# Altium schematic sheet STM32_Brain.SchDoc
size A2; SheetNumber: 1; SheetTotal: 1
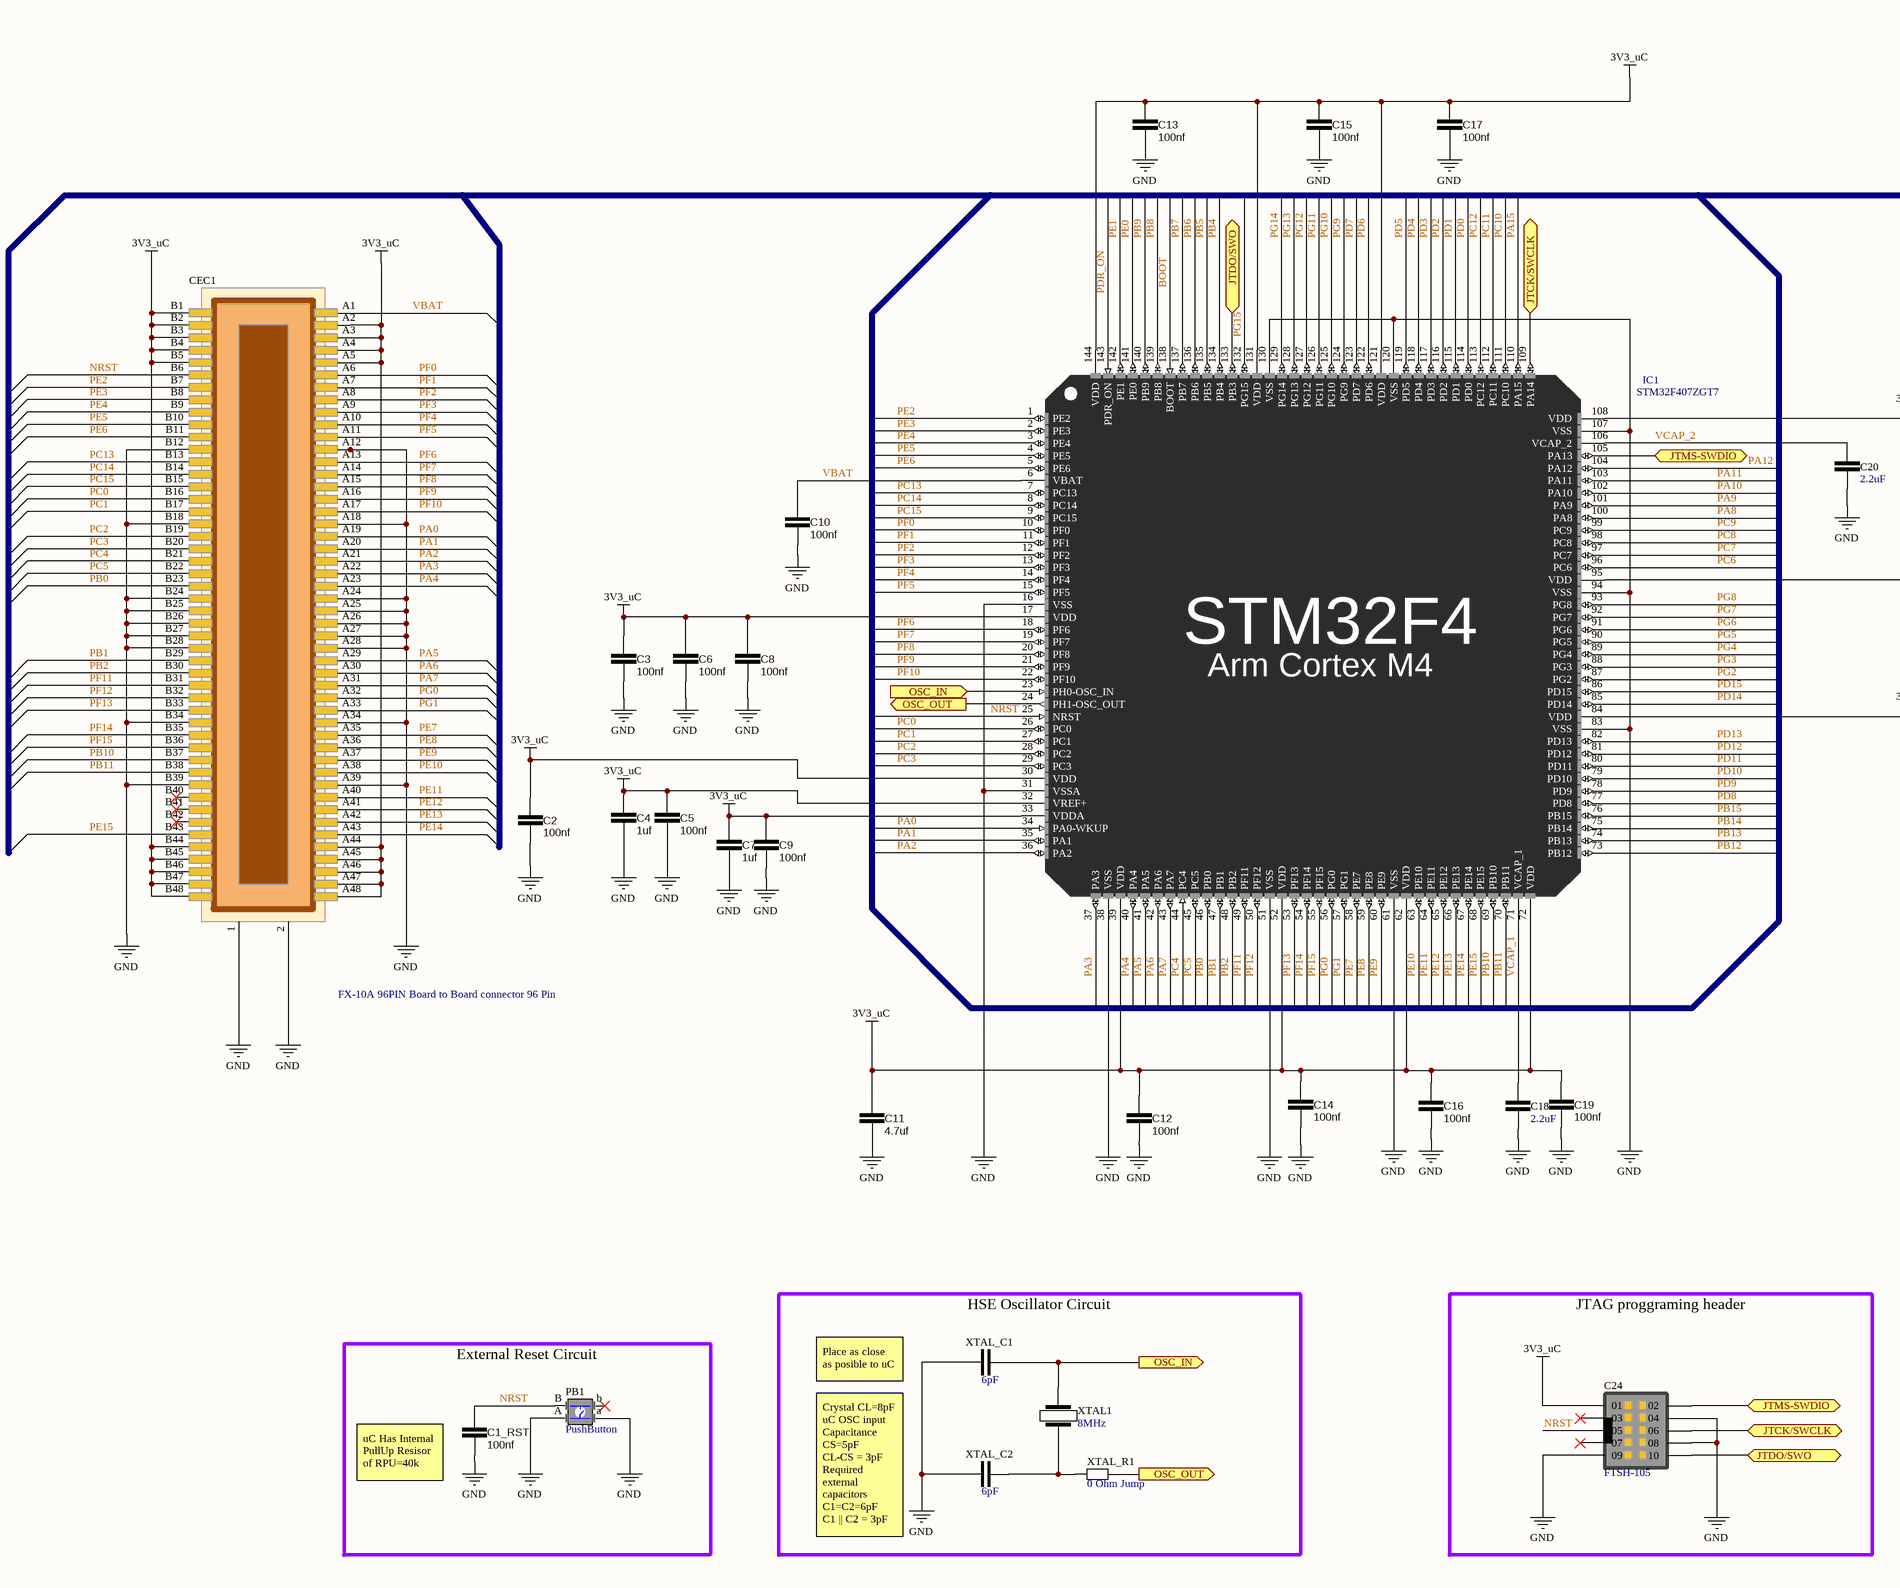
[diagram p0: STM32_Brain.SchDoc, left]
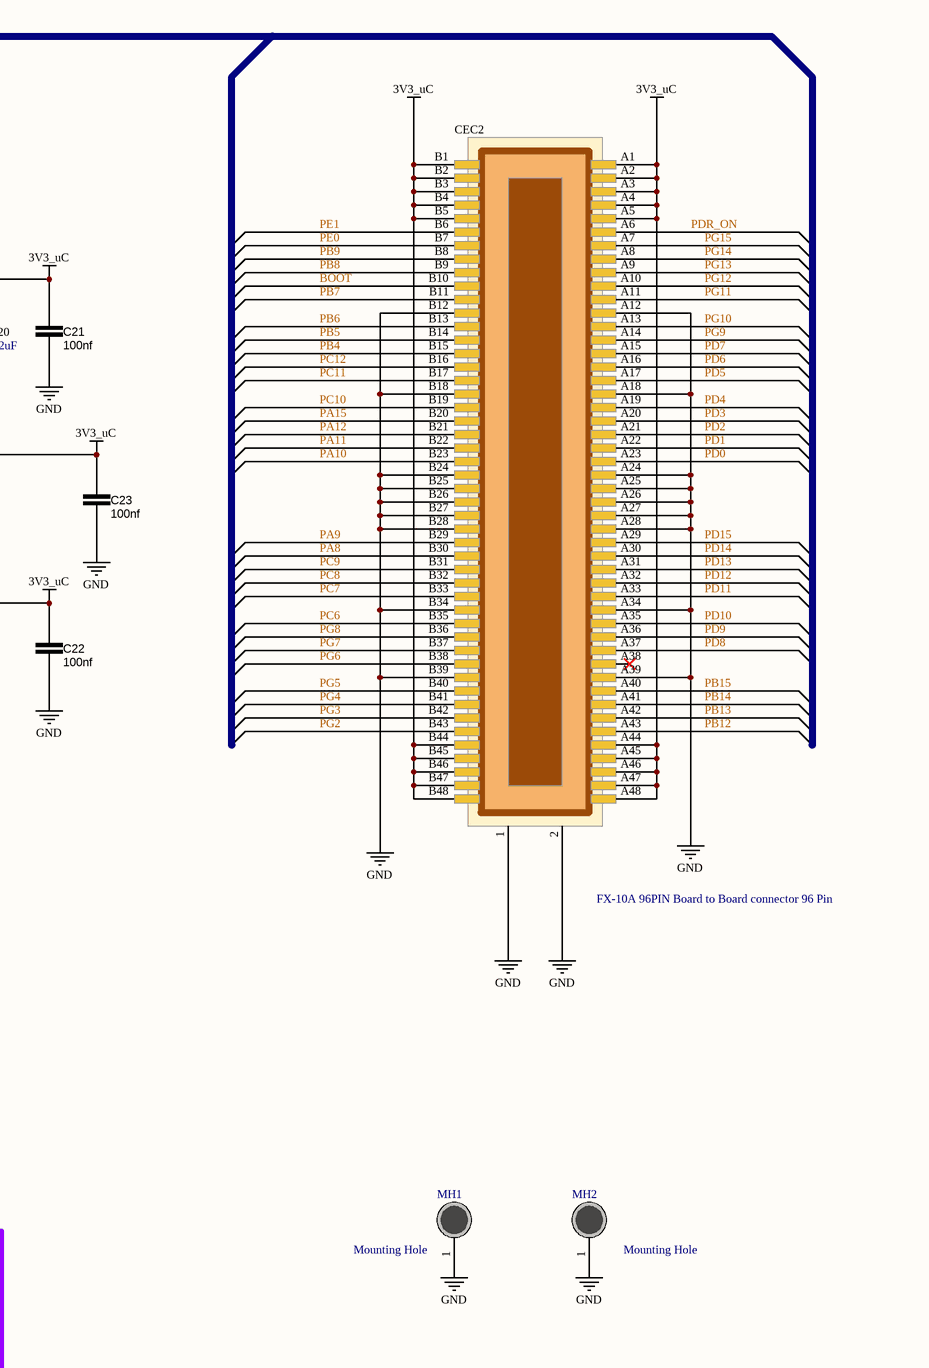
[diagram p1: STM32_Brain.SchDoc, right]

## Parts
C1_RST  100nf  [CAP_0603]
C2  100nf  [CAP_0603]
C3  100nf  [CAP_0603]
C4  1uf  [CAP_0603]
C5  100nf  [CAP_0603]
C6  100nf  [CAP_0603]
C7  1uf  [CAP_0603]
C8  100nf  [CAP_0603]
C9  100nf  [CAP_0603]
C10  100nf  [CAP_0603]
C11  4.7uf  [CAP_0805]
C12  100nf  [CAP_0603]
C13  100nf  [CAP_0603]
C14  100nf  [CAP_0603]
C15  100nf  [CAP_0603]
C16  100nf  [CAP_0603]
C17  100nf  [CAP_0603]
C18  2.2uF  [CAP_0603]
C19  100nf  [CAP_0603]
C20  2.2uF  [CAP_0603]
C21  100nf  [CAP_0603]
C22  100nf  [CAP_0603]
C23  100nf  [CAP_0603]
C24  FTSH-105  [10 Position SMT Connector]
CEC1  FX-10A 96PIN Board to Board connector 96 Pin  [Board To Board Connector]
CEC2  FX-10A 96PIN Board to Board connector 96 Pin  [Board To Board Connector]
IC1  STM32F407ZGT7  [TSQFP50P2260X2260X160-144N]
MH1  Mounting Hole  [HOLE-3mm]
MH2  Mounting Hole  [HOLE-3mm]
PB1  PushButton  [Tactile Switch]
XTAL1  8MHz  [XTAL-SMD]
XTAL_C1  6pF  [CAP_0402]
XTAL_C2  6pF  [CAP_0402]
XTAL_R1  0 Ohm Jump  [RES_0402]

## Ports
JTCK/SWCLK (bidir, see STM32_Brain[5B]), JTCK/SWCLK (bidir, see STM32_Brain[6D]), JTDO/SWO (bidir, see STM32_Brain[4B]), JTDO/SWO (bidir, see STM32_Brain[6D]), JTMS-SWDIO (bidir, see STM32_Brain[5B]), JTMS-SWDIO (bidir, see STM32_Brain[6D]), OSC_IN (in, see STM32_Brain[4D]), OSC_IN (out, see STM32_Brain[3C]), OSC_OUT (out, see STM32_Brain[3C]), OSC_OUT (out, see STM32_Brain[4D])

## Nets
3V3_uC: C2.2 C3.2 C4.2 C5.2 C6.2 C7.2 C8.2 C9.2 C11.2 C12.2 C13.2 C14.2 C15.2 C16.2 C17.2 C19.2 C21.2 C22.2 C23.2 C24.01 CEC1.A2 CEC1.A3 CEC1.A4 CEC1.A5 CEC1.A44 CEC1.A45 CEC1.A46 CEC1.A47 CEC1.A48 CEC1.B1 CEC1.B2 CEC1.B3 CEC1.B4 CEC1.B5 CEC1.B44 CEC1.B45 CEC1.B46 CEC1.B47 CEC1.B48 CEC2.A1 CEC2.A2 CEC2.A3 CEC2.A4 CEC2.A5 CEC2.A44 CEC2.A45 CEC2.A46 CEC2.A47 CEC2.A48 CEC2.B1 CEC2.B2 CEC2.B3 CEC2.B4 CEC2.B5 CEC2.B44 CEC2.B45 CEC2.B46 CEC2.B47 CEC2.B48 IC1.17(VDD) IC1.30(VDD) IC1.32(VREF+) IC1.33(VDDA) IC1.39(VDD) IC1.52(VDD) IC1.62(VDD) IC1.72(VDD) IC1.84(VDD) IC1.95(VDD) IC1.108(VDD) IC1.121(VDD) IC1.131(VDD) IC1.144(VDD)
GND: C1_RST.1 C2.1 C3.1 C4.1 C5.1 C6.1 C7.1 C8.1 C9.1 C10.1 C11.1 C12.1 C13.1 C14.1 C15.1 C16.1 C17.1 C18.1 C19.1 C20.1 C21.1 C22.1 C23.1 C24.04 C24.08 C24.09 CEC1.1 CEC1.2 CEC1.A12 CEC1.A18 CEC1.A24 CEC1.A25 CEC1.A26 CEC1.A27 CEC1.A28 CEC1.A34 CEC1.A39 CEC1.B12 CEC1.B18 CEC1.B24 CEC1.B25 CEC1.B26 CEC1.B27 CEC1.B28 CEC1.B34 CEC1.B39 CEC2.1 CEC2.2 CEC2.A12 CEC2.A18 CEC2.A24 CEC2.A25 CEC2.A26 CEC2.A27 CEC2.A28 CEC2.A34 CEC2.A39 CEC2.B12 CEC2.B18 CEC2.B24 CEC2.B25 CEC2.B26 CEC2.B27 CEC2.B28 CEC2.B34 CEC2.B39 IC1.16(VSS) IC1.31(VSSA) IC1.38(VSS) IC1.51(VSS) IC1.61(VSS) IC1.83(VSS) IC1.94(VSS) IC1.107(VSS) IC1.120(VSS) IC1.130(VSS) MH1.1 MH2.1 PB1.A PB1.a XTAL_C1.1 XTAL_C2.1
BOOT: CEC2.B10 IC1.138(BOOT)
JTCK/SWCLK: C24.06 IC1.109(PA14) ; port JTCK/SWCLK
JTDO/SWO: C24.10 IC1.133(PB3) ; port JTDO/SWO
JTMS-SWDIO: C24.02 IC1.105(PA13) ; port JTMS-SWDIO
NRST: C1_RST.2 C24.05 CEC1.B6 IC1.25(NRST) PB1.B
OSC_IN: IC1.23(PH0-OSC_IN) XTAL1.2 XTAL_C1.2 ; port OSC_IN
OSC_OUT: IC1.24(PH1-OSC_OUT) XTAL_R1.2 ; port OSC_OUT
PA0: CEC1.A19 IC1.34(PA0-WKUP)
PA1: CEC1.A20 IC1.35(PA1)
PA2: CEC1.A21 IC1.36(PA2)
PA3: CEC1.A22 IC1.37(PA3)
PA4: CEC1.A23 IC1.40(PA4)
PA5: CEC1.A29 IC1.41(PA5)
PA6: CEC1.A30 IC1.42(PA6)
PA7: CEC1.A31 IC1.43(PA7)
PA8: CEC2.B30 IC1.100(PA8)
PA9: CEC2.B29 IC1.101(PA9)
PA10: CEC2.B23 IC1.102(PA10)
PA11: CEC2.B22 IC1.103(PA11)
PA12: CEC2.B21 IC1.104(PA12)
PA15: CEC2.B20 IC1.110(PA15)
PB0: CEC1.B23 IC1.46(PB0)
PB1: CEC1.B29 IC1.47(PB1)
PB2: CEC1.B30 IC1.48(PB2)
PB4: CEC2.B15 IC1.134(PB4)
PB5: CEC2.B14 IC1.135(PB5)
PB6: CEC2.B13 IC1.136(PB6)
PB7: CEC2.B11 IC1.137(PB7)
PB8: CEC2.B9 IC1.139(PB8)
PB9: CEC2.B8 IC1.140(PB9)
PB10: CEC1.B37 IC1.69(PB10)
PB11: CEC1.B38 IC1.70(PB11)
PB12: CEC2.A43 IC1.73(PB12)
PB13: CEC2.A42 IC1.74(PB13)
PB14: CEC2.A41 IC1.75(PB14)
PB15: CEC2.A40 IC1.76(PB15)
PC0: CEC1.B16 IC1.26(PC0)
PC1: CEC1.B17 IC1.27(PC1)
PC2: CEC1.B19 IC1.28(PC2)
PC3: CEC1.B20 IC1.29(PC3)
PC4: CEC1.B21 IC1.44(PC4)
PC5: CEC1.B22 IC1.45(PC5)
PC6: CEC2.B35 IC1.96(PC6)
PC7: CEC2.B33 IC1.97(PC7)
PC8: CEC2.B32 IC1.98(PC8)
PC9: CEC2.B31 IC1.99(PC9)
PC10: CEC2.B19 IC1.111(PC10)
PC11: CEC2.B17 IC1.112(PC11)
PC12: CEC2.B16 IC1.113(PC12)
PC13: CEC1.B13 IC1.7(PC13)
PC14: CEC1.B14 IC1.8(PC14)
PC15: CEC1.B15 IC1.9(PC15)
PD0: CEC2.A23 IC1.114(PD0)
PD1: CEC2.A22 IC1.115(PD1)
PD2: CEC2.A21 IC1.116(PD2)
PD3: CEC2.A20 IC1.117(PD3)
PD4: CEC2.A19 IC1.118(PD4)
PD5: CEC2.A17 IC1.119(PD5)
PD6: CEC2.A16 IC1.122(PD6)
PD7: CEC2.A15 IC1.123(PD7)
PD8: CEC2.A37 IC1.77(PD8)
PD9: CEC2.A36 IC1.78(PD9)
PD10: CEC2.A35 IC1.79(PD10)
PD11: CEC2.A33 IC1.80(PD11)
PD12: CEC2.A32 IC1.81(PD12)
PD13: CEC2.A31 IC1.82(PD13)
PD14: CEC2.A30 IC1.85(PD14)
PD15: CEC2.A29 IC1.86(PD15)
PDR_ON: CEC2.A6 IC1.143(PDR_ON)
PE0: CEC2.B7 IC1.141(PE0)
PE1: CEC2.B6 IC1.142(PE1)
PE2: CEC1.B7 IC1.1(PE2)
PE3: CEC1.B8 IC1.2(PE3)
PE4: CEC1.B9 IC1.3(PE4)
PE5: CEC1.B10 IC1.4(PE5)
PE6: CEC1.B11 IC1.5(PE6)
PE7: CEC1.A35 IC1.58(PE7)
PE8: CEC1.A36 IC1.59(PE8)
PE9: CEC1.A37 IC1.60(PE9)
PE10: CEC1.A38 IC1.63(PE10)
PE11: CEC1.A40 IC1.64(PE11)
PE12: CEC1.A41 IC1.65(PE12)
PE13: CEC1.A42 IC1.66(PE13)
PE14: CEC1.A43 IC1.67(PE14)
PE15: CEC1.B43 IC1.68(PE15)
PF0: CEC1.A6 IC1.10(PF0)
PF1: CEC1.A7 IC1.11(PF1)
PF2: CEC1.A8 IC1.12(PF2)
PF3: CEC1.A9 IC1.13(PF3)
PF4: CEC1.A10 IC1.14(PF4)
PF5: CEC1.A11 IC1.15(PF5)
PF6: CEC1.A13 IC1.18(PF6)
PF7: CEC1.A14 IC1.19(PF7)
PF8: CEC1.A15 IC1.20(PF8)
PF9: CEC1.A16 IC1.21(PF9)
PF10: CEC1.A17 IC1.22(PF10)
PF11: CEC1.B31 IC1.49(PF11)
PF12: CEC1.B32 IC1.50(PF12)
PF13: CEC1.B33 IC1.53(PF13)
PF14: CEC1.B35 IC1.54(PF14)
PF15: CEC1.B36 IC1.55(PF15)
PG0: CEC1.A32 IC1.56(PG0)
PG1: CEC1.A33 IC1.57(PG1)
PG2: CEC2.B43 IC1.87(PG2)
PG3: CEC2.B42 IC1.88(PG3)
PG4: CEC2.B41 IC1.89(PG4)
PG5: CEC2.B40 IC1.90(PG5)
PG6: CEC2.B38 IC1.91(PG6)
PG7: CEC2.B37 IC1.92(PG7)
PG8: CEC2.B36 IC1.93(PG8)
PG9: CEC2.A14 IC1.124(PG9)
PG10: CEC2.A13 IC1.125(PG10)
PG11: CEC2.A11 IC1.126(PG11)
PG12: CEC2.A10 IC1.127(PG12)
PG13: CEC2.A9 IC1.128(PG13)
PG14: CEC2.A8 IC1.129(PG14)
PG15: CEC2.A7 IC1.132(PG15)
VBAT: C10.2 CEC1.A1 IC1.6(VBAT)
VCAP_1: C18.2 IC1.71(VCAP_1)
VCAP_2: C20.2 IC1.106(VCAP_2)
NetXTAL1_1: XTAL1.1 XTAL_C2.2 XTAL_R1.1

Not connected (* = marked no-connect by the designer): C24 03* 07*; CEC1 B40(40)* B41(41)* B42(42)*; CEC2 A38(38)*; PB1 b*

## Notes on the sheet
- Place as close as posible to uC
- (near C1_RST) uC Has Internal PullUp Resisor of RPU=40k
- External Reset Circuit
- HSE Oscillator Circuit
- Crystal CL=8pF
  uC OSC input Capacitance CS=5pF
  CL-CS = 3pF
  Required external capacitors C1=C2=6pF
  C1 || C2 = 3pF
- (near C24) JTAG proggraming header
- (in symbol STM32F407ZGT7) STM32F4; Arm Cortex M4; SPI / INTERFACE

## Library data of the parts
C1_RST C2 C3 C5 C6 C8-C10 C12-C17 C19 C21-C23 = 0000007: CAP CER 100nF 0603 25V X7R; capaticanse: 100nf; ComponentLink1Description: digikey; ComponentLink1URL: https://www.digikey.com/en/products/detail/kyocera-avx/06033C104K4T2A/8019250
C4 C7 = 0000009: CAP CER 1uF 0603 16V X7R; capaticanse: 1uf; ComponentLink1Description: digikey; ComponentLink1URL: https://www.digikey.com/en/products/detail/samsung-electro-mechanics/CL10B105KO8NNNC/3886677; DigiKey part number: 1276-1019-2-ND
C11 = 0000003: CAP CER 4.7uF 0805 25V X5R; capaticanse: 4.7uf; ComponentLink1Description: digikey; ComponentLink1URL: https://www.digikey.com/en/products/detail/kemet/C0805C475K3PAC7800/1950665
C18 C20 = 0000014: CAP CER 2.2UF 16V X7S 0603; capaticanse: 2.2uF; ComponentLink1Description: Digikey; ComponentLink1URL: https://www.digikey.com/en/products/detail/murata-electronics/GRM188C71C225KE11D/4905311; Digikey Part Number: 490-12731-1-ND
C24 = 00000009: FTSH-105-01-F-DV-K - CONN HEADER SMD 10POS 1.27MM; DigiKey Part Number: SAM8796-ND; MOUSER Part Number: 200-FTSH10501LDVKPTR; ComponentLink1Description: DigiKey Link; ComponentLink1URL: https://www.digikey.com/en/products/detail/samtec-inc/FTSH-105-01-F-DV-K/2649974; ComponentLink2Description: MOUSER Link; ComponentLink2URL: https://eu.mouser.com/ProductDetail/Samtec/FTSH-105-01-L-DV-K-P-TR?qs=fnpEE5GccuMUjCRgxv4voQ%3D%3D
CEC1 CEC2 = 00000008: CONN RCPT 96POS SMD GOLD; Digikey Part Number: H122463-ND; ComponentLink1Description: Digikey; ComponentLink1URL: https://www.digikey.com/en/products/detail/hirose-electric-co-ltd/FX10A-96S-SV/2041894
IC1 = STM32F407ZGT7: ARM® Cortex®-M4 STM32F4 Microcontroller IC 32-Bit Single-Core 168MHz 1MB (1M x 8) FLASH 144-LQFP (20x20); Supplier 2: DigiKey; Supplier 1: Mouser; Supplier Part Number 1: 511-STM32F407ZGT7; Supplier 2 Part Number: 497-17439-ND; ComponentLink1Description: Supplier 2 Link; ComponentLink1URL: https://www.digikey.com/en/products/detail/stmicroelectronics/STM32F407ZGT7/4357413?s=N4IgTCBcDaIMoBUCyBmMAxALABgOwC0BxBXEAXQF8g; ComponentLink2Description: Supplier 1 Link; ComponentLink2URL: https://eu.mouser.com/ProductDetail/STMicroelectronics/STM32F407ZGT7?qs=%2F%2FVjtefuLz5lDAduqBtUGQ%3D%3D
MH1 MH2 = 00000006: Mounting Hole 3mm
PB1 = 00000010: SWITCH TACTILE SPST-NO 0.02A 15V; DigiKey Part Number: P12937SCT-ND; ComponentLink1Description: DigiKey; ComponentLink1URL: https://www.digikey.com/en/products/detail/panasonic-electronic-components/EVQ-Q2F03W/762887
XTAL1 = 00000004: CRYSTAL 8.0000MHZ 8PF SMD; frequency: 8MHz; DigiKey Part Number: 644-STDCSU1-8MTR-ND; ComponentLink1Description: DigiKey; ComponentLink1URL: https://www.digikey.com/en/products/detail/ndk-america-inc/STDCSU1-8M/1788472
XTAL_C1 XTAL_C2 = 0000016: CAP CER 6PF 25V C0G/NP0 0402; capacitanse: 6pF; DigiKey Part Number: 399-CBR04C609D3GACCT-ND; ComponentLink1Description: DigiKey; ComponentLink1URL: https://www.digikey.com/en/products/detail/kemet/CBR04C609D3GAC/18137865?s=N4IgjCBcpgLFoDGUBmBDANgZwKYBoQB7KAbXAFYBOAJlgHYQBdAgBwBcoQBlNgJwEsAdgHMQAXwJgAbAhDJI6bPiKkQAZkphyADiasOkbnyGiJIagAZYlWfMW4CxSGSkACFgDE9IdpwCqgvxsAPIoALI4aFgArrw44gQAtNS2UHzRyk5k5ExieUA
XTAL_R1 = R000008: RES SMD 0 OHM JUMPER 1/10W 0402; resistance: 0 Ohm Jump; DigiKey Part Number: P0.0JCT-ND; ComponentLink1Description: DigiKey; ComponentLink1URL: https://www.digikey.com/en/products/detail/panasonic-electronic-components/ERJ-2GE0R00X/146727